# Altium schematic sheet Endstops.SchDoc: Endstops
size Letter; SheetNumber: 7; SheetTotal: 12
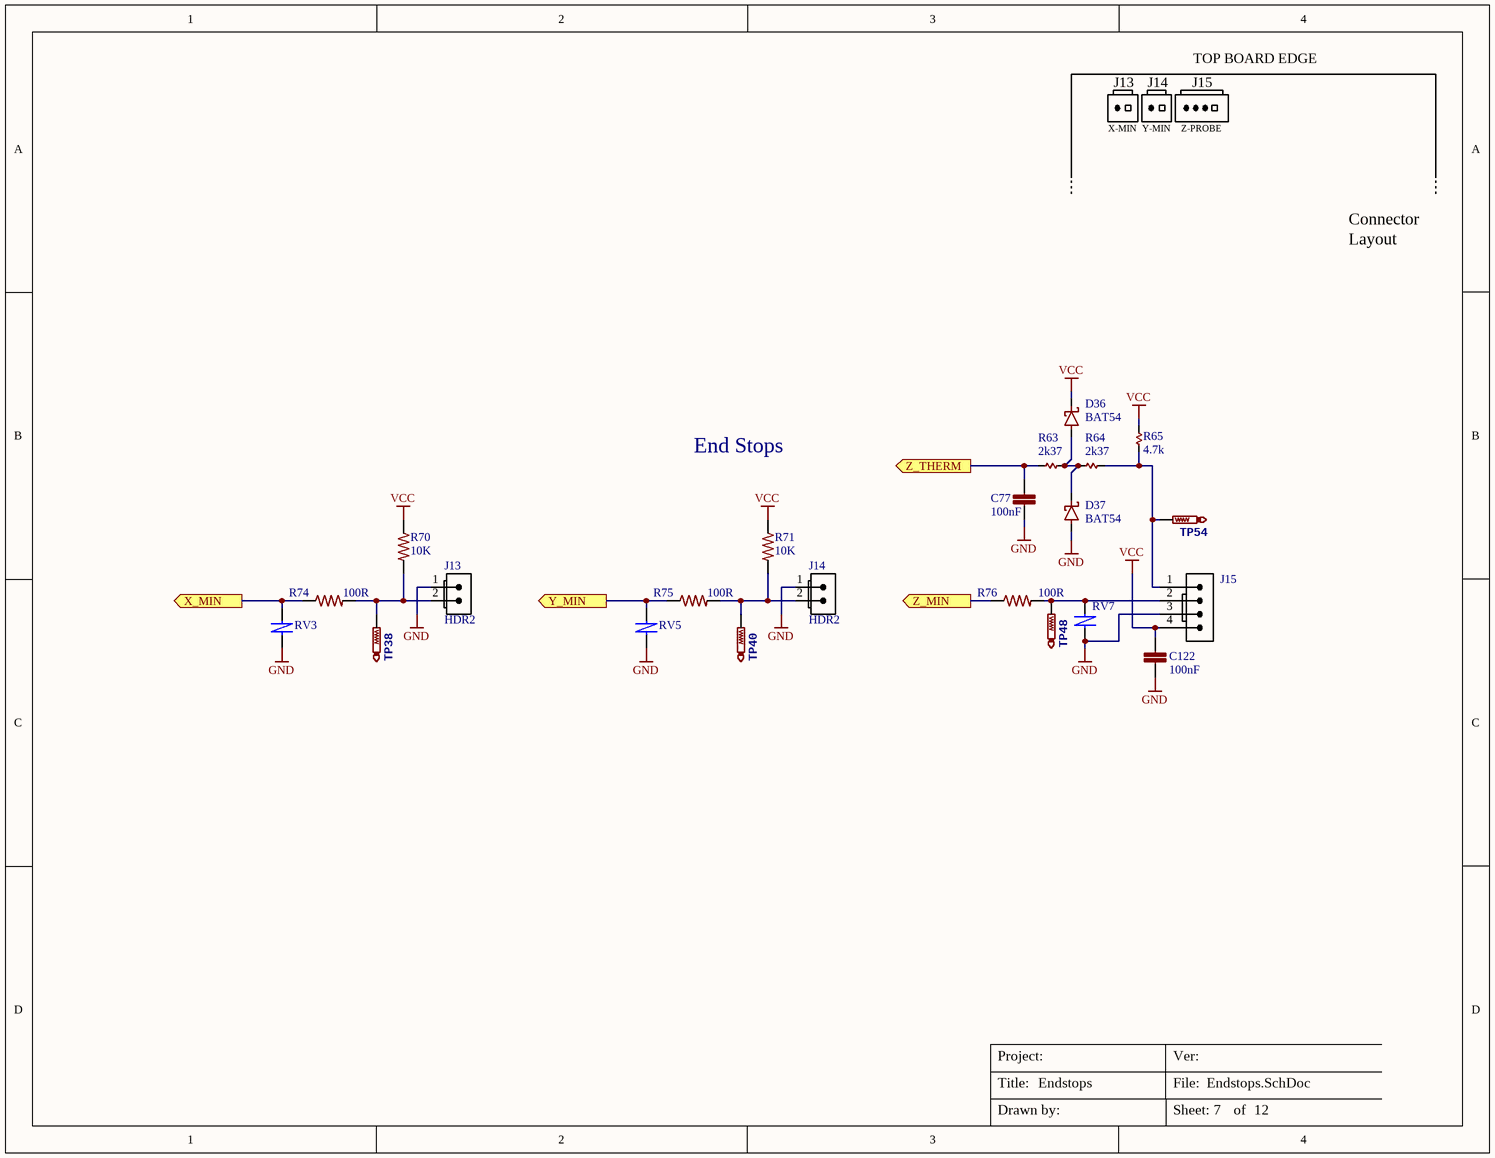
[diagram p0: Endstops.SchDoc]

## Parts
C77  100nF  [C0402]
C122  100nF  [C0402]
D36  BAT54  [SOD523_IPC]
D37  BAT54  [SOD523_IPC]
J13  value HDR2  [70543-02]  (hidden comment: CONN 2PIN VERT 0.1" SHRD LOCKING)
J14  value HDR2  [70543-02]  (hidden comment: CONN 2PIN VERT 0.1" SHRD LOCKING)
J15  Molex 0705430003  [4POL254]  (value not drawn)
R63  2k37  [R0402]
R64  2k37  [R0402]
R65  4.7k  [R0402]
R70  10K  [R0402]
R71  10K  [R0402]
R74  100R  [R0402]
R75  100R  [R0402]
R76  100R  [R0402]
RV3  VRS0402SR55R101N  [C0402]  (value not drawn)
RV5  VRS0402SR55R101N  [C0402]  (value not drawn)
RV7  VRS0402SR55R101N  [C0402]  (value not drawn)
TP38  TestPoint  [TP1-27]  (value not drawn)  (no BOM)
TP40  TestPoint  [TP1-27]  (value not drawn)  (no BOM)
TP48  TestPoint  [TP1-27]  (value not drawn)  (no BOM)
TP54  TestPoint  [TP1-27]  (value not drawn)  (no BOM)

## Ports
X_MIN, Y_MIN, Z_MIN, Z_THERM

## Nets
GND: C77.2 C122.1 D37.A J13.1(S) J14.1(S) J15.3 RV3.1 RV5.1 RV7.1
VCC: C122.2 D36.K J15.4 R65.2 R70.1 R71.1
X_MIN: R74.1 RV3.2 ; port X_MIN
Y_MIN: R75.1 RV5.2 ; port Y_MIN
Z_MIN: R76.1 ; port Z_MIN
Z_THERM: C77.1 R63.2 ; port Z_THERM
NetD36_A: D36.A D37.K R63.1 R64.2
NetJ13_2: J13.2(S) R70.2 R74.2 TP38.TP
NetJ14_2: J14.2(S) R71.2 R75.2 TP40.TP
NetJ15_1: J15.1 R64.1 R65.1 TP54.TP
NetJ15_2: J15.2 R76.2 RV7.2 TP48.TP

## Notes on the sheet
- J13
- J14
- J15
- TOP BOARD EDGE
- X-MIN
- Y-MIN
- Z-PROBE
- Connector
- Layout
- End Stops
- Title:
- Project:
- File:
- Ver:
- Drawn by:
- Sheet:
- of

## Library data of the parts
C77 = GRM155R71C104KA88D: CAP CER 0402 100nF 16V 10% X7R; Manufacturer: Murata; Part Description: 0.10µF ±10% 16V Ceramic Capacitor X7R 0402 (1005 Metric); EE_SPEC: 100nF 16V X7R 0402; Tolerance: +/- 10%; VALUE: 100nF; MANUFACTURER #: GRM155R71C104KA88D; DISTRIBUTOR #: 490-3261-2-ND; DISTRIBUTOR: Digi-Key; PART: 100nF
C122 = GRM155R71C104KA88D: CAP CER 0402 100nF 16V 10% X7R; MANUFACTURER: Murata; PART DESCRIPTION: 0.10µF ±10% 16V Ceramic Capacitor X7R 0402 (1005 Metric); TOLERANCE: +/- 10%; EE_SPEC: 100nF 16V X7R 0402; VALUE: 100nF; MANUFACTURER #: GRM155R71C104KA88D; DISTRIBUTOR #: 490-3261-2-ND; DISTRIBUTOR: Digi-Key; PART: 100nF
D36 D37 = BAT54WT-7: Diode Schottky 30V 100mA Surface Mount SOD-523; Manufacturer: Diodes Incorporated; EE_SPEC: 30V 0.1A; Tolerance: NA; Value: BAT54; MANUFACTURER #: BAT54WT-7; DISTRIBUTOR #: BAT54WT-7DI-ND; DISTRIBUTOR: Digi-Key; PART: BAT54; Part Description: Diode Schottky 30V 100mA Surface Mount SOD-523
J13 J14 = CONN 2PIN VERT 0.1" SHRD LOCKING: Connector 2pos; MANUFACTURER: Molex; MANUFACTURER #: 0705430001; PART: 10 Pin Conn; PART DESCRIPTION: 2 Positions Header, Shrouded Connector 0.100" (2.54mm) Through Hole Gold; TOLERANCE: -NA-; DISTRIBUTOR #: WM4800-ND; DISTRIBUTOR: Digi-Key; EE_SPEC: -NA-
J15 = CONN 4PIN 0.1" VERT SHRD LOCK ALT: Molex 4 Pin Clip Connector; MANUFACTURER #: 0705430038; PART: 4 Pin Conn; PART DESCRIPTION: 4 Positions Header, Shrouded Connector 0.100" (2.54mm) Through Hole Tin; TOLERANCE: -NA-; VALUE: HDR4; MANUFACTURER: Molex; DISTRIBUTOR #: WM4826-ND; DISTRIBUTOR: Digi-Key; EE_SPEC: -NA-
R63 R64 = RC0402FR-072K37L: RES SMD 2.37K OHM 1% 1/16W 0402; Manufacturer: Yageo; Part Description: 2.37k Ohm ±1% 0.063W, 1/16W Chip Resistor 0402 (1005 Metric) Moisture Resistant Thick Film; EE_SPEC: 2.37k 1% 0402; Tolerance: +/- 1%; VALUE: 2k37; MANUFACTURER #: RC0402FR-072K37L; DISTRIBUTOR #: 311-2.37KLRTR-ND; DISTRIBUTOR: Digi-Key; PART: 2.37k
R65 = RC0402FR-074K7L: RES SMD 4.7K OHM 1% 1/16W 0402; Manufacturer: Yageo; Part Description: 4.7k Ohm ±1% 0.063W, 1/16W Chip Resistor 0402 (1005 Metric) Moisture Resistant Thick Film; EE_SPEC: 4.7k 1% 0402; Tolerance: +/- 1%; VALUE: 4.7k; MANUFACTURER #: RC0402FR-074K7L; DISTRIBUTOR #: 311-4.7KLRTR-ND; DISTRIBUTOR: Digi-Key; PART: 4.7k
R70 R71 = RC0402FR-0710KP: RES SMD 10K OHM 1% 1/16W 0402; MANUFACTURER: Yageo; PART: 10k 1% 0402; PART DESCRIPTION: 10k Ohm ±1% 0.063W, 1/16W Chip Resistor 0402 (1005 Metric) Moisture Resistant Thick Film; EE_SPEC: 10k 1% 0402 1/16W; VALUE: 10K; MANUFACTURER #: RC0402FR-0710KP; DISTRIBUTOR #: YAG1249TR-ND; DISTRIBUTOR: Digi-Key; TOLERANCE: 1%
R74-R76 = RES 100R 0402 1%: RES SMD 100 OHM 1% 1/16W 0402; MANUFACTURER: Yageo; MANUFACTURER #: RC0402FR-07100RL; PART: 100R 1% 0402; PART DESCRIPTION: 100 Ohm ±1% 0.063W, 1/16W Chip Resistor 0402 (1005 Metric) Moisture Resistant Thick Film; VALUE: 100R; DISTRIBUTOR #: 311-100LRTR-ND; DISTRIBUTOR: Digi-Key; TOLERANCE: 1%; EE_SPEC: 100R 1% 0402
RV3 RV5 RV7 = VRS0402SR55R101N: Multi-Layer Varistor; Manufacturer: Yageo; Part Description: VARISTOR 12V 10A 0402; Value: 12V; EE_SPEC: 5.5Vdc 12Vvar 60pF; Tolerance: NA; DISTRIBUTOR #: 311-1516-2-ND; DISTRIBUTOR: Digi-Key; MANUFACTURER #: VRS0402SR55R101N; PART: 12V
TP38 TP40 TP48 TP54 = TestPoint: Test Point